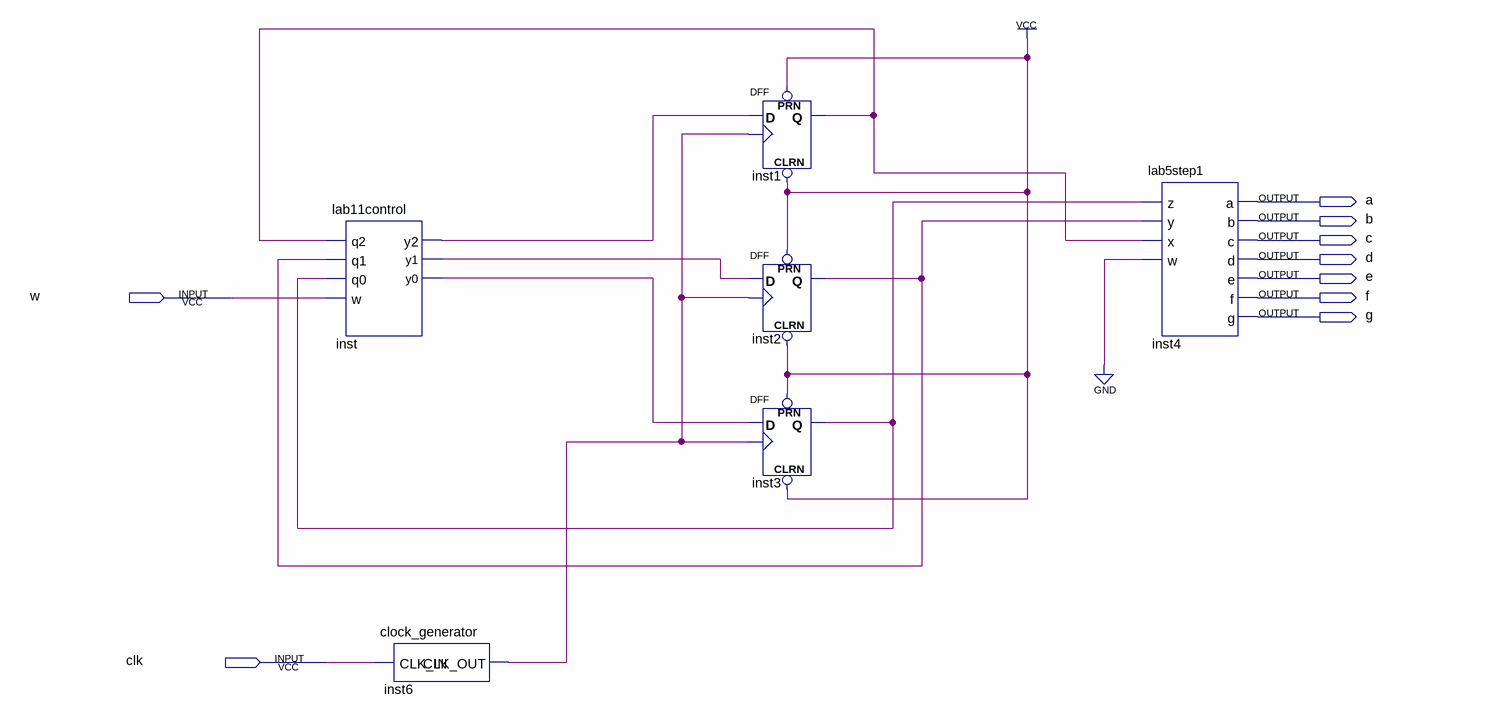
[diagram p0: schematic sheet]
// Quartus schematic Lab11step2.bdf as structural Verilog: 6 symbols, 9 pins
module Lab11step2 (
  input  w,
  input  clk,
  output a,
  output b,
  output c,
  output d,
  output e,
  output f,
  output g
);

  wire inst1_q, inst2_q, inst3_q, inst6_clk_out, inst_y0, inst_y1, inst_y2;

  lab11control inst (.q2(inst1_q), .q1(inst2_q), .q0(inst3_q), .w(w), .y2(inst_y2), .y1(inst_y1), .y0(inst_y0));
  clock_generator inst6 (.CLK_IN(clk), .CLK_OUT(inst6_clk_out));
  DFF inst1 (.CLRN(1'b1), .CLK(inst6_clk_out), .D(inst_y2), .PRN(1'b1), .Q(inst1_q));
  DFF inst2 (.CLRN(1'b1), .CLK(inst6_clk_out), .D(inst_y1), .PRN(1'b1), .Q(inst2_q));
  DFF inst3 (.CLRN(1'b1), .CLK(inst6_clk_out), .D(inst_y0), .PRN(1'b1), .Q(inst3_q));
  lab5step1 inst4 (.z(inst3_q), .x(inst1_q), .w(1'b0), .y(inst2_q), .a(a), .b(b), .c(c), .d(d), .e(e), .f(f), .g(g));
endmodule
